# EAGLE design LineAmp (EAGLE 7.1.0)
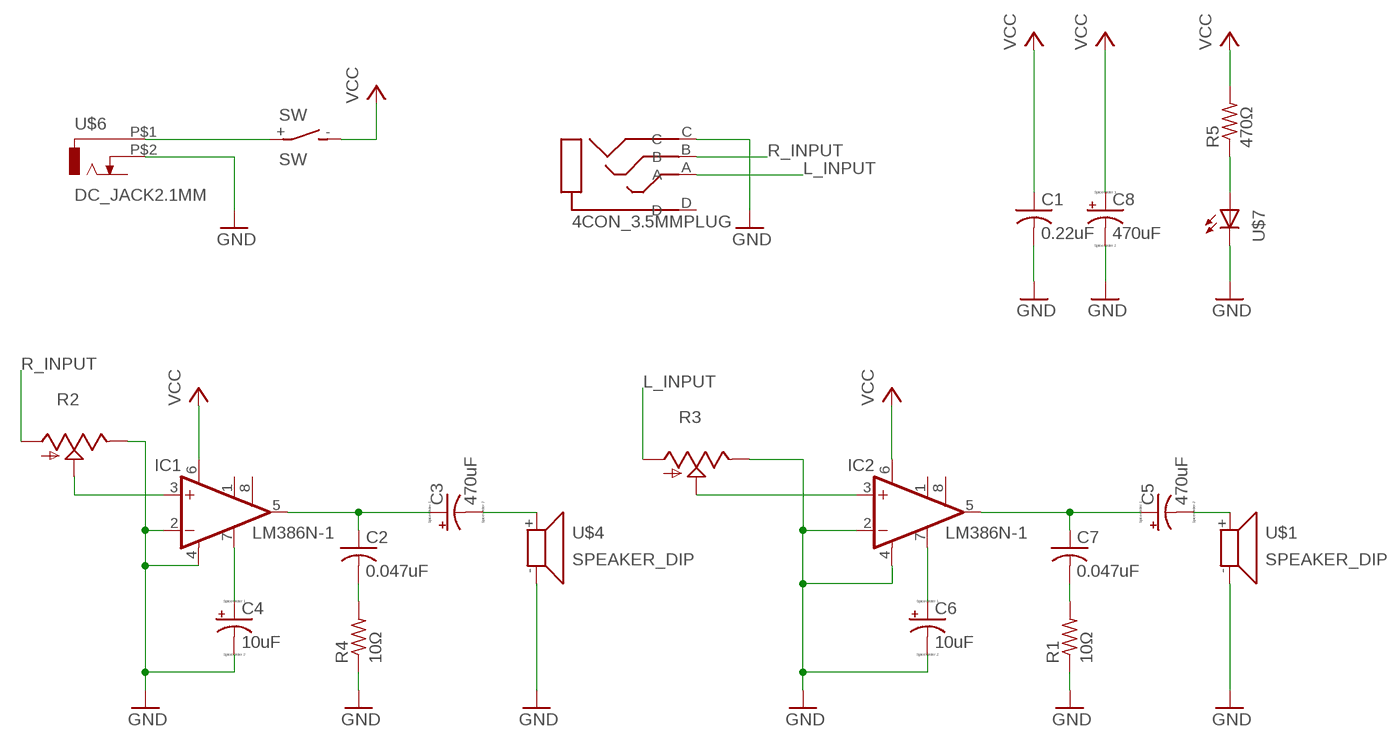
[diagram p0: schematic, sheet 1]

## Parts
C1  0.22uF  C-US075-042X103  [C075-042X103]
C2  0.047uF  C-US050-024X044  [C050-024X044]
C3  470uF  CPOL-USE7.5-16  [E7,5-16]
C4  10uF  CPOL-USE2-5  [E2-5]
C5  470uF  CPOL-USE7.5-16  [E7,5-16]
C6  10uF  CPOL-USE2-5  [E2-5]
C7  0.047uF  C-US050-024X044  [C050-024X044]
C8  470uF  CPOL-USE7.5-16  [E7,5-16]
IC1  LM386N-1  [DIL08]
IC2  LM386N-1  [DIL08]
R1  10Ω  R-US_M1206  [M1206]
R2  TRIM_US-ALPS-PANEL  [ALPS-POT-PANEL]
R3  TRIM_US-ALPS-PANEL  [ALPS-POT-PANEL]
R4  10Ω  R-US_M1206  [M1206]
R5  470Ω  R-US_M1206  [M1206]
SW  SW  [2PIN_DIP]
U$1  SPEAKER_DIP  [2PIN_DIP]
U$4  SPEAKER_DIP  [2PIN_DIP]
U$5  4CON_3.5MMPLUG  [4PIN_DIP]
U$6  DC_JACK2.1MM  [DC_JACK2.1MM]
U$7  LED5MM  [5MM]

## Nets
GND: C1.2 C4.- C6.- C8.- IC1.2(-IN) IC1.4(GND) IC2.2(-IN) IC2.4(GND) R1.1 R2.P$1(E) R3.P$1(E) R4.1 U$1.- U$4.- U$5.C U$6.P$2 U$7.OUT(C)
L_INPUT: R3.P$3(A) U$5.A
N$1: IC2.3(+IN) R3.P$2(S)
N$2: C4.+ IC1.7(BYPASS)
N$3: IC1.3(+IN) R2.P$2(S)
N$4: C6.+ IC2.7(BYPASS)
N$5: C2.1 C3.+ IC1.5(OUT)
N$6: C3.- U$4.+
N$7: C5.+ C7.1 IC2.5(OUT)
N$8: C5.- U$1.+
N$9: C2.2 R4.2
N$10: C7.2 R1.2
N$11: R5.1 U$7.IN(A)
N$12: SW.+(P) U$6.P$1
R_INPUT: R2.P$3(A) U$5.B
VCC: C1.1 C8.+ IC1.6(VS) IC2.6(VS) R5.2 SW.-(S)
Unconnected: IC1.1(GAIN) IC1.8(GAIN) IC2.1(GAIN) IC2.8(GAIN) U$5.D

## Library data of the parts
C1 C2 C7 = 01_EasyAccessLib:C-US: CAPACITOR, American symbol
C3-C6 C8 = 01_EasyAccessLib:CPOL-US: POLARIZED CAPACITOR, American symbol
IC1 IC2 = linear:LM386?-*: Low Voltage Audio Power Amplifier Source: http://cache.national.com/ds/LM/LM386.pdf
R1 R4 R5 = 01_EasyAccessLib:R-US_: RESISTOR, American symbol
R2 R3 = 01_EasyAccessLib:TRIM_US-: POTENTIOMETER
SW = 02_MyOriginalLib:SW
U$1 U$4 = 02_MyOriginalLib:SPEAKER_DIP
U$5 = 02_MyOriginalLib:4CON_3.5MMPLUG
U$6 = 02_MyOriginalLib:DC_JACK2.1MM
U$7 = 01_EasyAccessLib:LED

## Board
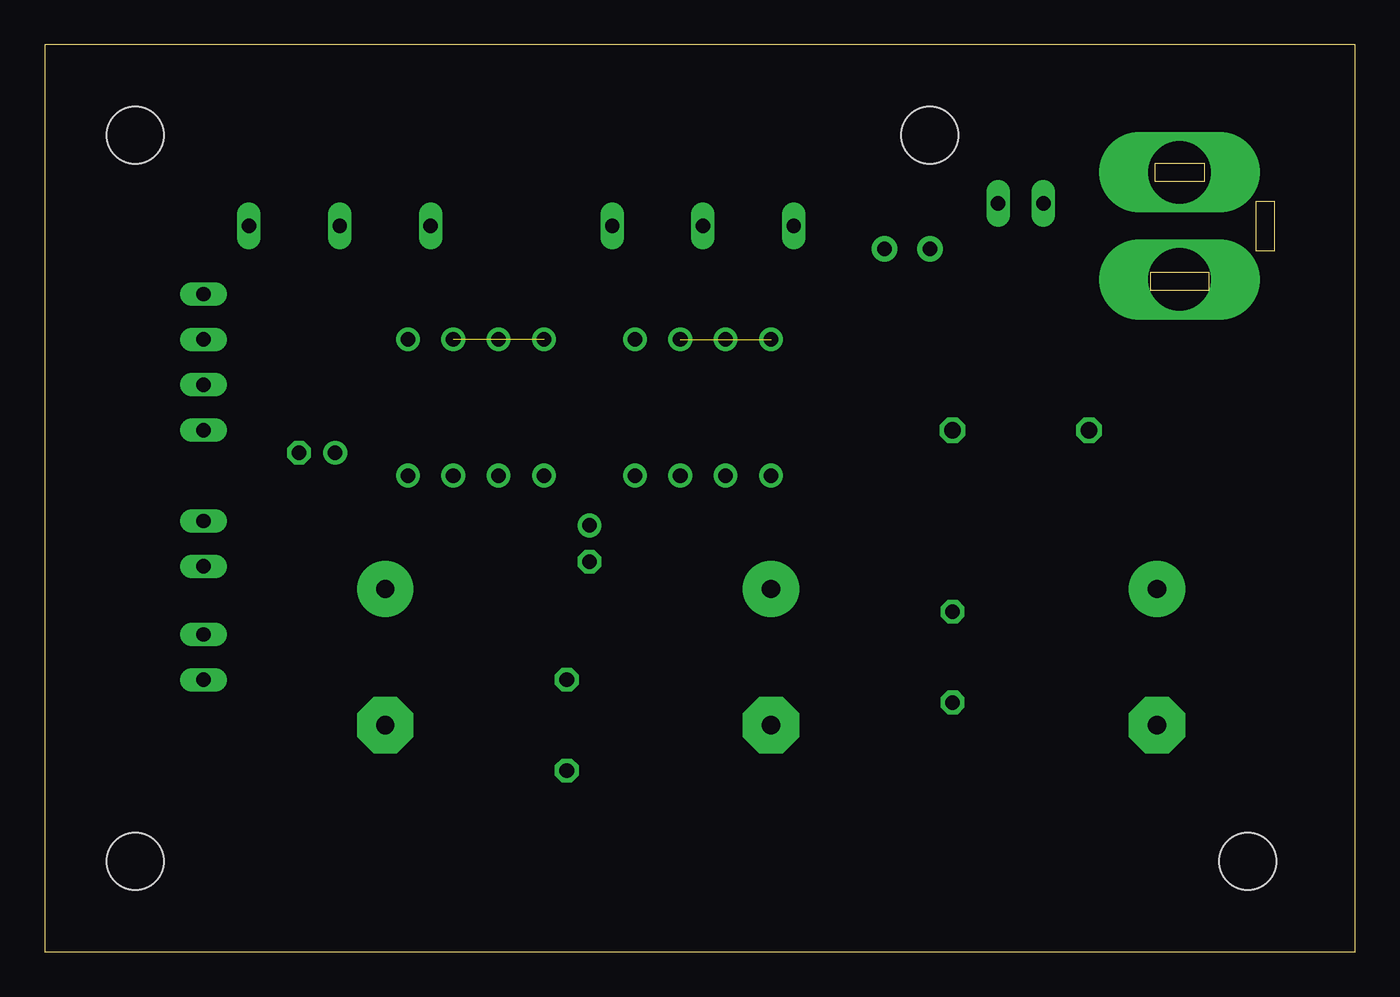
[diagram p1: board, top side]
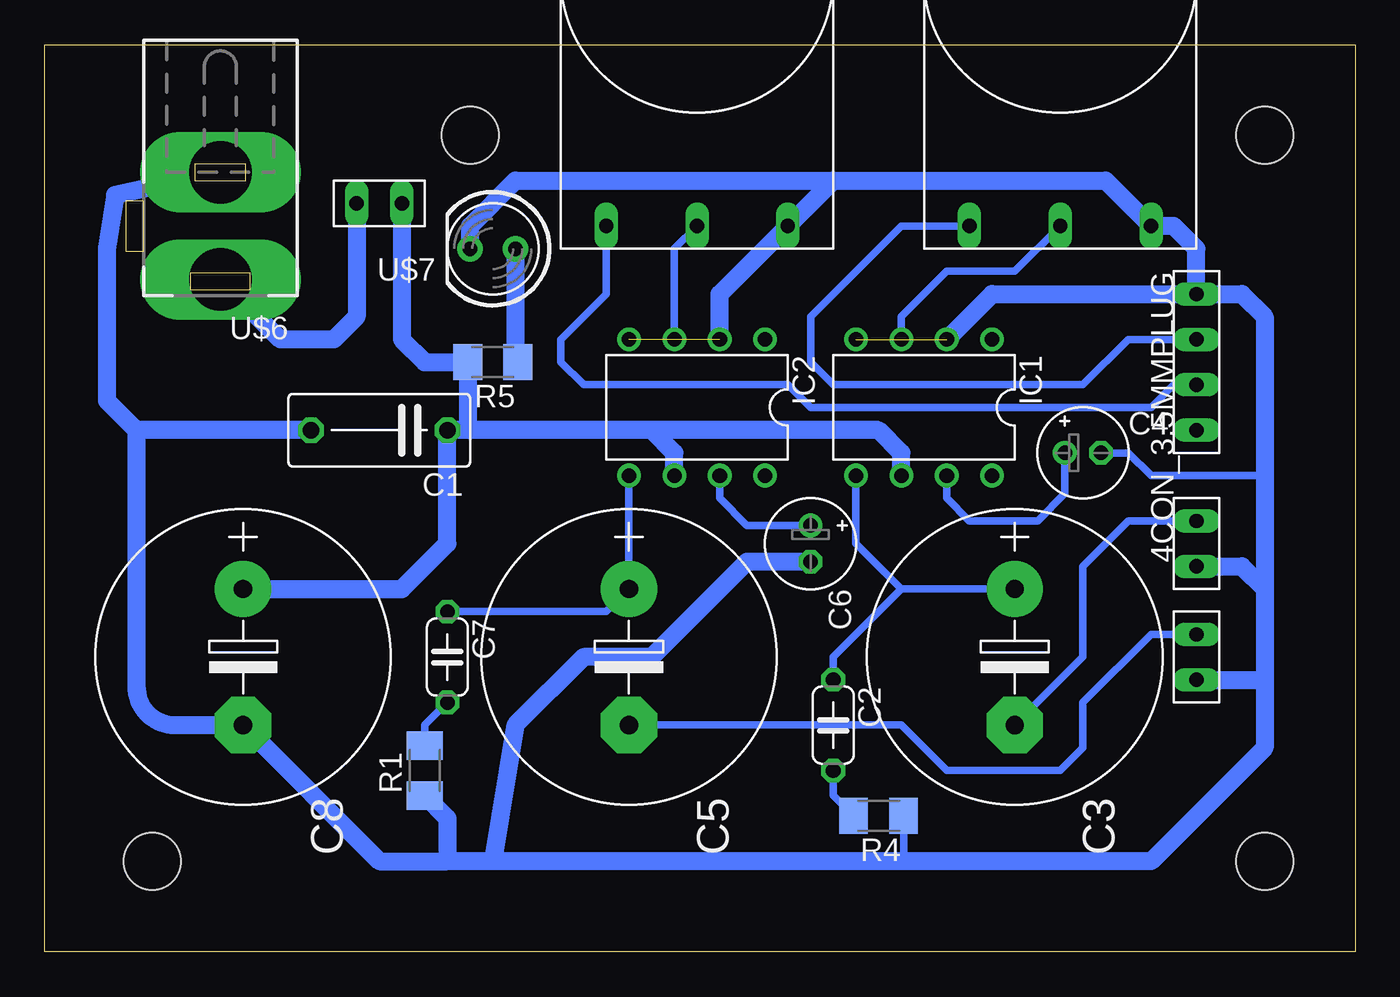
[diagram p2: board, bottom side, seen from below]

Size 73.33 x 50.79 mm. Coordinates in mm from the lower left corner, seen from the top.
Outline: 0,0 73.33,0 73.33,50.79 0,50.79 0,0
Copper layers (1*16): Top 0.035mm / dielectric 1.5mm / Bottom 0.035mm
Design rules "default *": minimum track width 10mil, minimum drill 24mil, track to track 0.4mm, track to pad 0.4mm, pad to pad 0.4mm, via to via 0.4mm, smd to smd 0.4mm, copper to edge 40mil, drill to drill 8mil, minimum pad ring 10mil, minimum via ring 8mil, stop-mask expansion 4mil, vias tented up to drill 0mil, thermal gap 10mil
Holes 3.2 mm at 5.08,5.08 67.31,5.08 5.08,45.72 49.53,45.72

### Footprints (pad centres in the part's own frame; a part is rotated, then mirrored left to right if it is on the bottom)
C075-042X103 = drill 0.914 octagon: 1 -3.81,0; 2 3.81,0
C050-024X044 = drill 0.813 octagon: 1 -2.54,0; 2 2.54,0
E7,5-16 = drill 1.016 pad 3.15: + -3.81,0 | drill 1.016 pad 3.15 octagon: - 3.81,0
E2-5 = drill 0.813 pad 1.27: + -1.016,0 | drill 0.813 pad 1.27 octagon: - 1.016,0
DIL08 = drill 0.813 pad 1.27: 1 -3.81,-3.81; 2 -1.27,-3.81; 3 1.27,-3.81; 4 3.81,-3.81; 5 3.81,3.81; 6 1.27,3.81; 7 -1.27,3.81; 8 -3.81,3.81
M1206 = smd 1.6 x 2: 1 -1.4,0; 2 1.4,0
ALPS-POT-PANEL = drill 0.8 long: P$1 5.08,-13.97; P$2 0,-13.97; P$3 -5.08,-13.97
2PIN_DIP = drill 0.8 long: + -1.27,0; - 1.27,0
4PIN_DIP = drill 0.8 long: A 1.27,0; B -1.27,0; C -3.81,0; D 3.81,0
DC_JACK2.1MM = drill 3.5 long: P$1 0,3; P$2 0,-3
5MM = drill 0.813 pad 1.422: IN -1.27,0; OUT 1.27,0

### Placement (x,y rotation side)
C1  54.61,29.21 180 bottom
C2  29.21,12.7 270 bottom
C3  19.05,16.51 270 bottom
C4  15.24,27.94 0 bottom
C5  40.64,16.51 270 bottom
C6  30.48,22.86 270 bottom
C7  50.8,16.51 270 bottom
C8  62.23,16.51 270 bottom
IC1  24.13,30.48 180 bottom
IC2  36.83,30.48 180 bottom
R1  52.07,10.16 90 bottom
R2  16.51,54.61 0 bottom
R3  36.83,54.61 0 bottom
R4  26.67,7.62 180 bottom
R5  48.26,33.02 180 bottom
SW  54.61,41.91 0 bottom
U$1  8.89,16.51 270 bottom
U$4  8.89,22.86 270 bottom
U$5  8.89,33.02 270 bottom
U$6  63.5,40.64 180 bottom
U$7  48.26,39.37 180 bottom

### Tracks (layer width: path | path; a pad name or v marks a point on that pad's centre or on a via)
GND  (2 unrouted)
  Bottom 0.406: C4.- 12.7,27.94 11.43,26.67 5.08,26.67 | R4.1 25.27,5.21 25.4,5.08
  Bottom 1.016: 68.2,29.21 68.2,14.86 arc-90 66.04,12.7 C8.- 54.61,5.08 50.8,5.08 | 48.26,5.08 25.4,5.08 11.43,5.08 5.08,11.43 5.08,15.24 | 48.26,5.08 50.8,5.08 | U$4.- 6.35,21.59 5.08,20.32 | 5.08,20.32 5.08,15.24 | U$5.C 6.35,36.83 5.08,35.56 5.08,26.67 5.08,20.32 | U$5.C 8.89,39.37 10.16,40.64 R2.P$1 13.97,43.18 29.21,43.18 | 29.21,43.18 R3.P$1 35.56,36.83 IC2.2 | C6.- 34.04,21.84 39.37,16.51 43.18,16.51 46.99,12.7 48.26,5.08 | IC1.2 20.32,36.83 U$5.C | R1.1 50.8,7.49 50.8,5.08 | C1.2 68.2,29.21 | U$7.OUT 49.53,40.64 46.99,43.18 29.21,43.18 | U$6.P$2 69.39,42.37 69.85,39.37 69.85,30.86 68.2,29.21 | U$1.- 5.08,15.24
L_INPUT
  Bottom 0.406: R3.P$3 41.91,36.83 44.45,34.29 44.45,33.02 43.18,31.75 31.75,31.75 30.48,30.48 11.43,30.48 10.16,31.75 U$5.A
N$1
  Bottom 0.406: IC2.3 38.1,39.37 R3.P$2
N$2
  Bottom 0.406: C4.+ 16.26,25.65 17.78,24.13 21.59,24.13 22.86,25.4 IC1.7
N$3
  Bottom 0.406: R2.P$2 19.05,38.1 22.86,38.1 25.4,35.56 IC1.3
N$4
  Bottom 0.406: C6.+ 34.04,23.88 35.56,25.4 IC2.7
N$5
  Bottom 0.406: C3.+ 25.4,20.32 | 25.4,20.32 27.94,22.86 IC1.5 | C2.1 29.21,16.51 25.4,20.32
N$6
  Bottom 0.406: C3.- 15.24,16.51 15.24,21.59 12.7,24.13 U$4.+
N$7
  Bottom 0.406: IC2.5 C5.+ 41.91,19.05 C7.1
N$8
  Bottom 0.406: 10.16,17.78 U$1.+ 11.43,17.78 15.24,13.97 15.24,11.43 16.51,10.16 22.86,10.16 25.4,12.7 C5.-
N$9
  Bottom 0.406: R4.2 29.21,8.76 C2.2
N$10
  Bottom 0.406: C7.2 52.07,12.7 R1.2
N$11
  Bottom 1.016: U$7.IN 46.99,33.15 R5.1
N$12
  Bottom 1.016: SW.+ 55.88,35.56 57.15,34.29 60.15,34.29 U$6.P$1
R_INPUT
  Bottom 0.406: R2.P$3 25.4,40.64 30.48,35.56 30.48,33.02 29.21,31.75 15.24,31.75 12.7,34.29 U$5.B
VCC
  Bottom 1.016: C8.+ 53.34,20.32 50.8,22.86 C1.1 49.53,29.21 | IC2.6 38.1,27.94 39.37,29.21 | 39.37,29.21 49.53,29.21 | IC1.6 25.4,27.94 26.67,29.21 39.37,29.21 | SW.- 53.34,34.29 52.07,33.02 R5.2 49.66,29.34 49.53,29.21